# EAGLE design Sedmiseg. display (EAGLE 5.06)

## Sheet 1 of 3
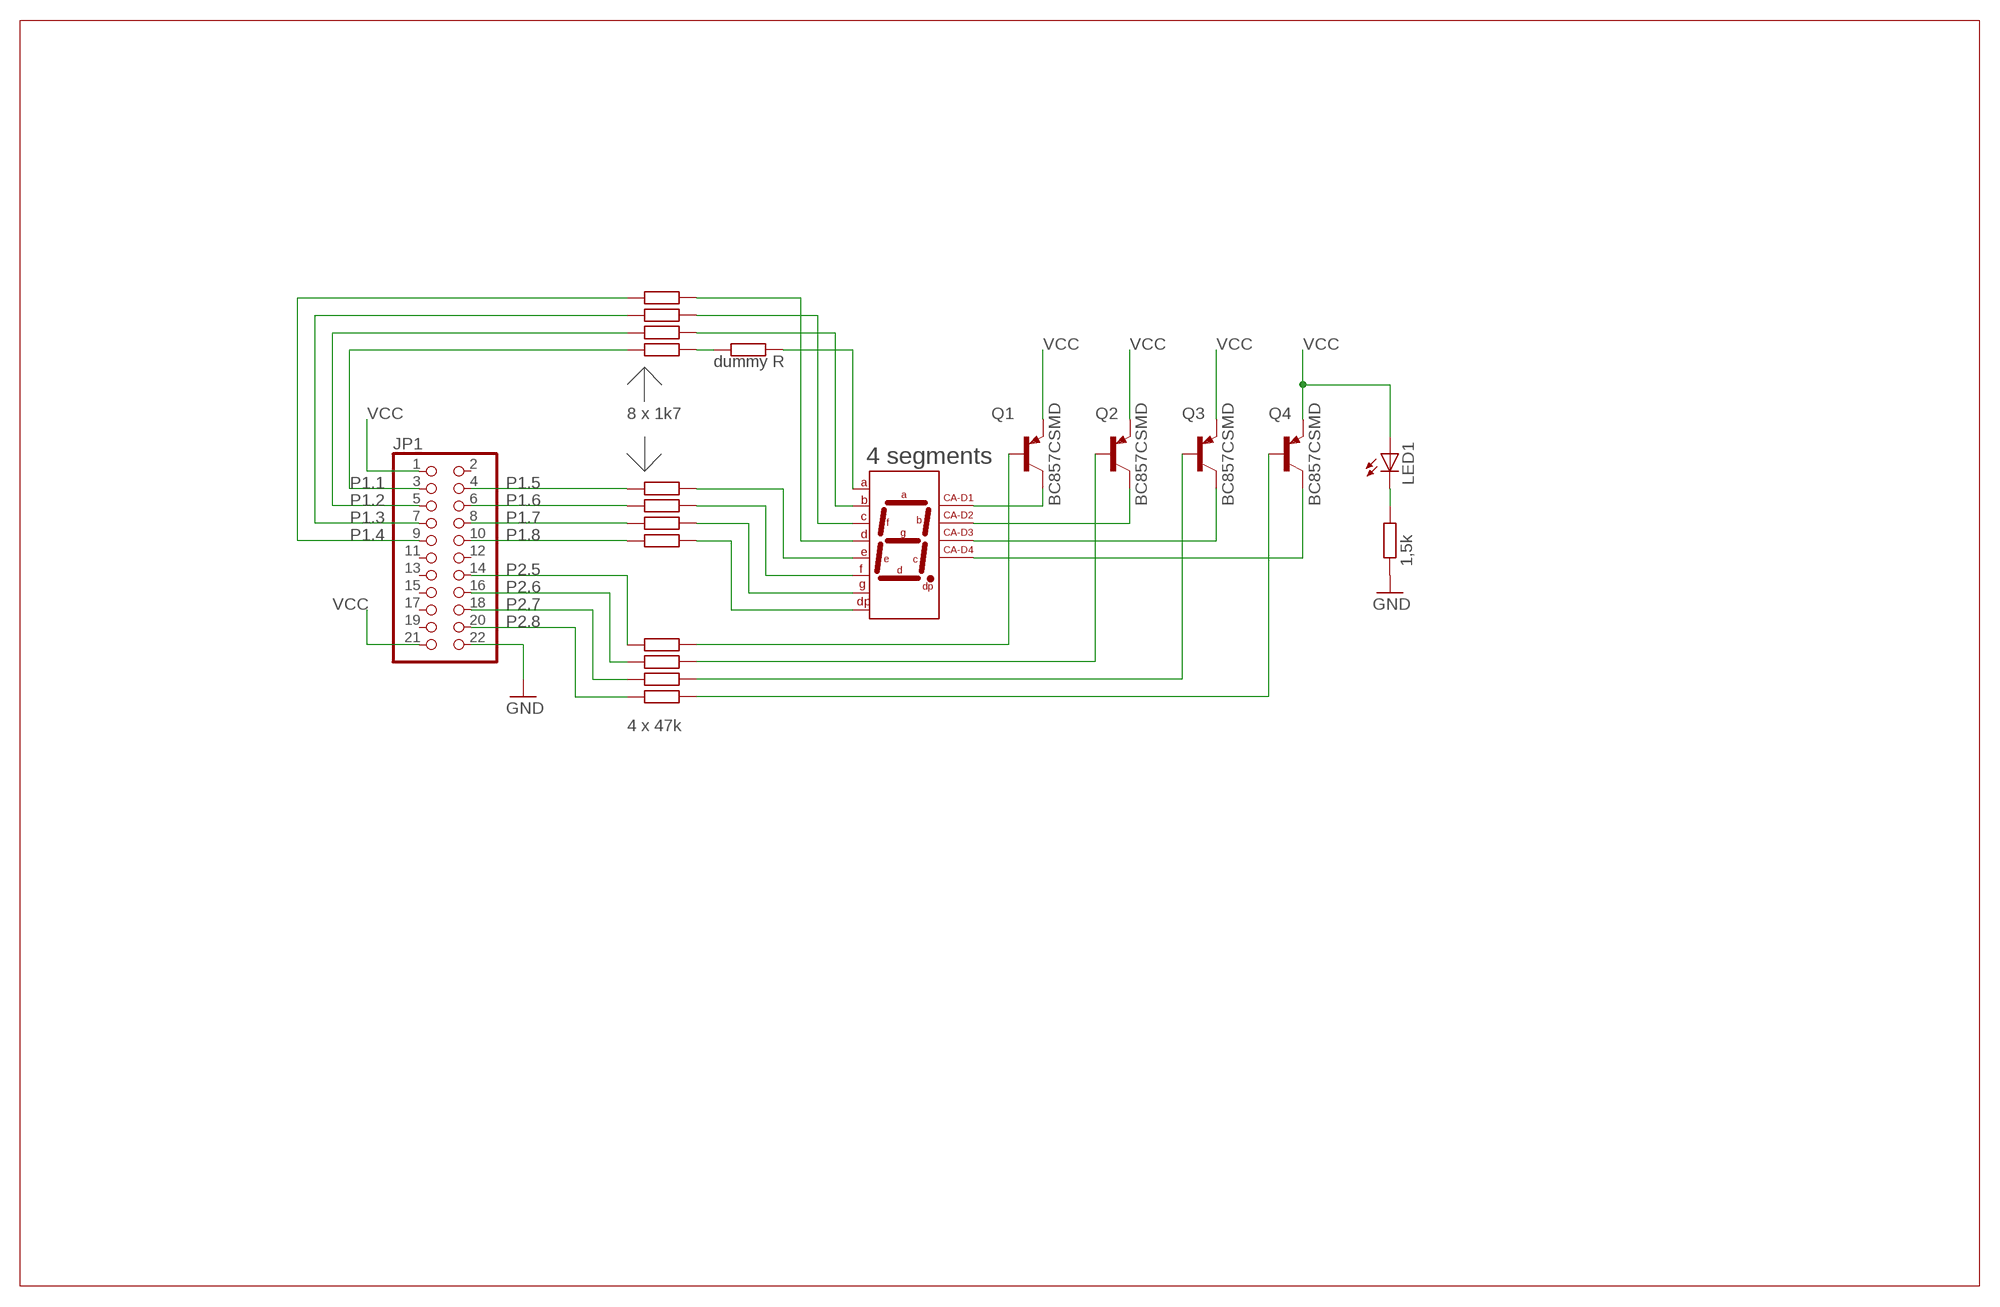
[diagram p0: schematic, sheet 1]

### Parts
H1  HD-M512RD  [HDM51X]
JP1  PINHD-2X11_2.54-90°  [2X11/90]
LED1  LED3MM  [LED3MM]
Q1  BC857CSMD  [SOT23-BEC]
Q2  BC857CSMD  [SOT23-BEC]
Q3  BC857CSMD  [SOT23-BEC]
Q4  BC857CSMD  [SOT23-BEC]
R1  R-EU_M1206  [M1206]
R2  R-EU_M1206  [M1206]
R3  R-EU_M1206  [M1206]
R4  R-EU_M1206  [M1206]
R5  R-EU_M1206  [M1206]
R6  R-EU_M1206  [M1206]
R7  R-EU_M1206  [M1206]
R8  R-EU_M1206  [M1206]
R9  R-EU_M1206  [M1206]
R10  R-EU_M1206  [M1206]
R11  R-EU_M1206  [M1206]
R12  R-EU_M1206  [M1206]
R13  R-EU_M1206  [M1206]
R14  1,5k  R-EU_M1206  [M1206]

### Nets
GND: JP1.22 R14.1
N$1: H1.12(CA-D1) Q1.C
N$2: H1.9(CA-D2) Q2.C
N$3: H1.8(CA-D3) Q3.C
N$4: H1.6(CA-D4) Q4.C
N$5: H1.10(F) R6.2
N$6: H1.5(G) R7.2
N$7: H1.3(DP) R8.2
N$8: LED1.K(C) R14.2
N$9: H1.1(E) R5.2
N$17: H1.2(D) R1.2
N$18: H1.4(C) R2.2
N$19: H1.7(B) R3.2
N$20: H1.11(A) R9.2
N$21: R4.2 R9.1
N$38: Q1.B R10.2
N$40: Q2.B R11.2
N$41: Q4.B R13.2
N$42: Q3.B R12.2
P1.1: JP1.3 R4.1
P1.2: JP1.5 R3.1
P1.3: JP1.7 R2.1
P1.4: JP1.9 R1.1
P1.5: JP1.4 R5.1
P1.6: JP1.6 R6.1
P1.7: JP1.8 R7.1
P1.8: JP1.10 R8.1
P2.5: JP1.14 R10.1
P2.6: JP1.16 R11.1
P2.7: JP1.18 R12.1
P2.8: JP1.20 R13.1
VCC: JP1.1 JP1.21 LED1.A Q1.E Q2.E Q3.E Q4.E
Unconnected: JP1.2 JP1.11 JP1.12 JP1.13 JP1.15 JP1.17 JP1.19

### Notes on the sheet
- dummy R
- 8 x 1k7
- 4 segments
- 4 x 47k

## Sheet 2 of 3
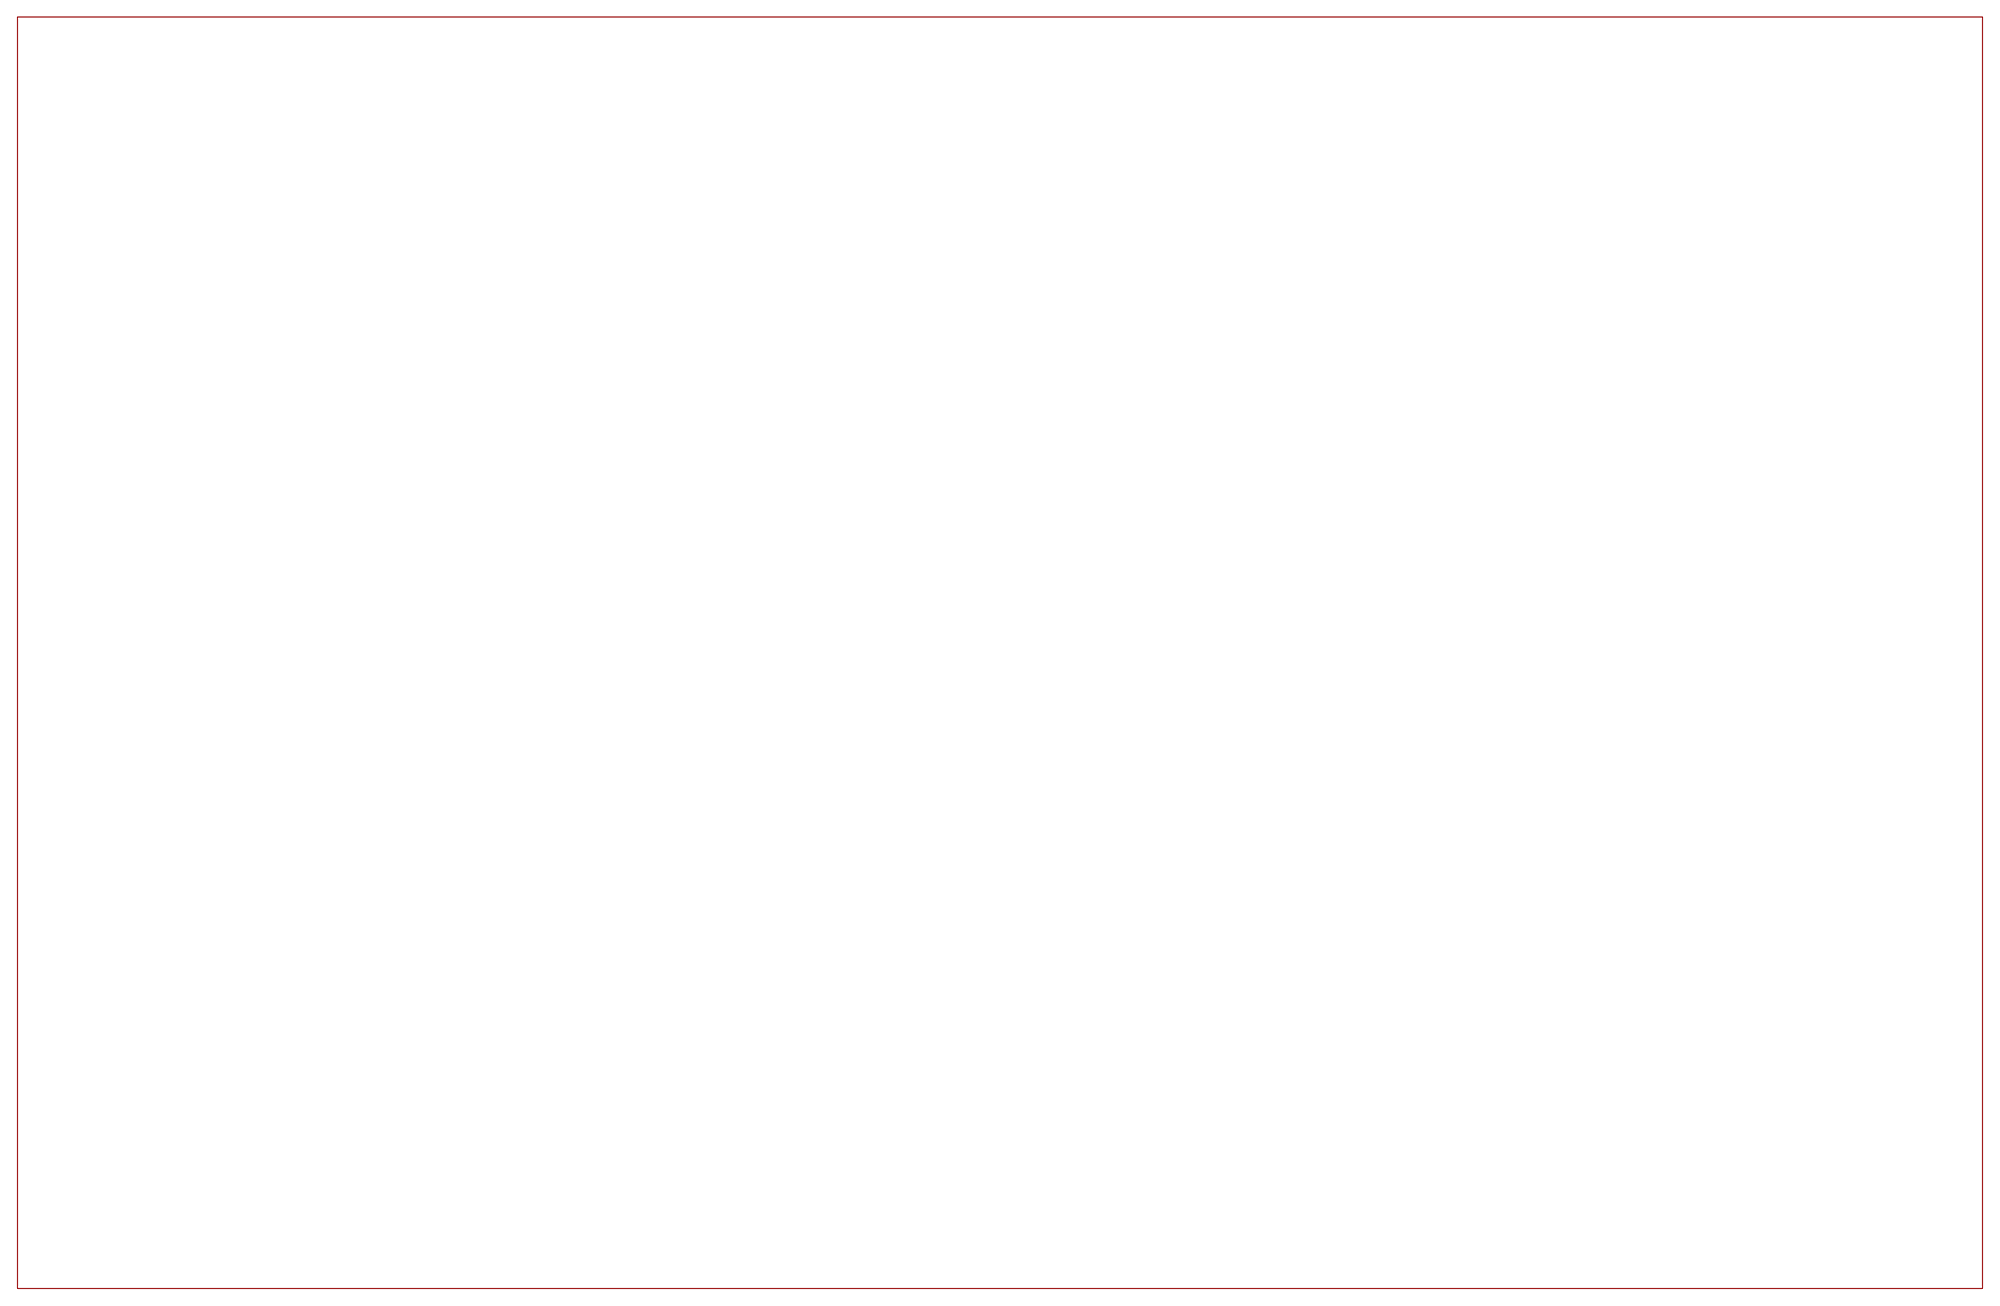
[diagram p1: schematic, sheet 2]

## Sheet 3 of 3
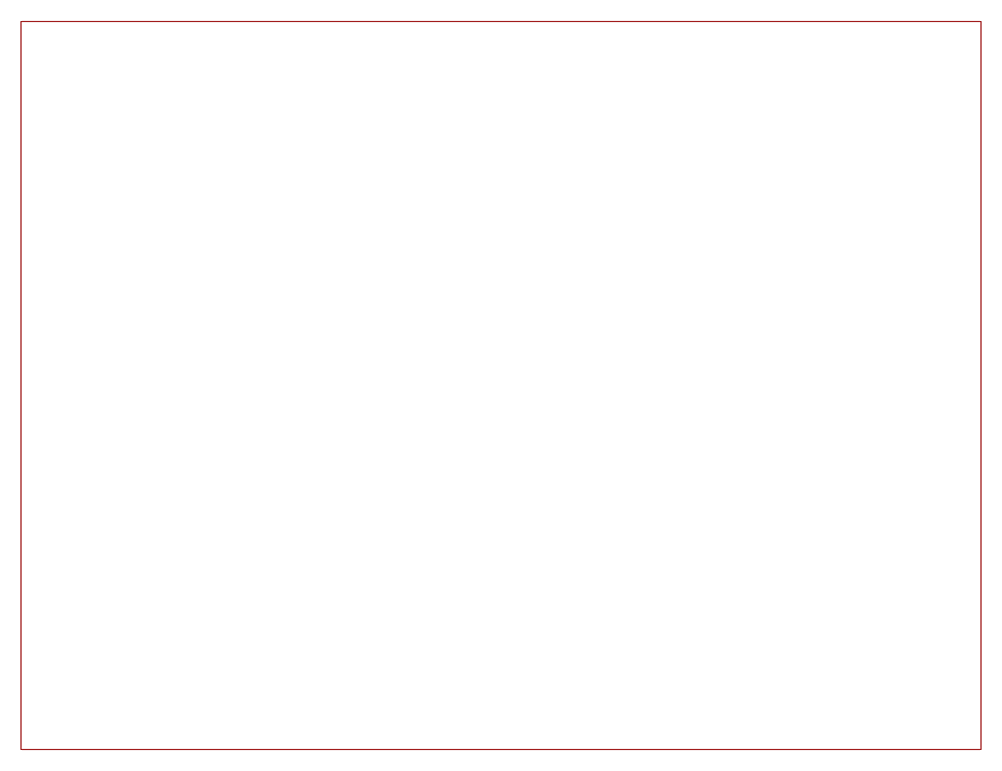
[diagram p2: schematic, sheet 3]

## Library data of the parts
H1 = #_GM99:HD-M512RD
JP1 = acon-tyco (19):PINHD-2X11: PIN HEADER
LED1 = led:LED: LED OSRAM: - CHIPLED LG R971, LG N971, LY N971, LG Q971, LY Q971, LO R971, LY R971 LH N974, LH R974 LS Q976, LO Q976, LY Q976 LO Q996 - Hyper CHIPLED LW Q18S LB Q993, LB Q99A, LB R99A - SideLED LS A670, LO A670, LY A670, LG A670, LP A670 LB A673, LV A673, LT A673, LW A673 LH A674 LY A675 LS A676, LA A676, LO A676, LY A676, LW A676 LS A679, LY A679, LG A679 - Hyper Micro SIDELED® LS Y876, LA Y876, LO Y876, LY Y876 LT Y87S - SmartLED LW L88C, LW L88S LB L89C, LB L89S, LG L890 LS L89K, LO L89K, LY L89K LS L896, LA L896, LO L896, LY L896 - TOPLED LS T670, LO T670, LY T670, LG T670, LP T670 LSG T670, LSP T670, LSY T670, LOP T670, LYG T670 LG T671, LOG T671, LSG T671 LB T673, LV T673, LT T673, LW T673 LH T674 LS T676, LA T676, LO T676, LY T676, LB T676, LH T676, LSB T676, LW T676 LB T67C, LV T67C, LT T67C, LS T67K, LO T67K, LY T67K, LW E67C LS E67B, LA E67B, LO E67B, LY E67B, LB E67C, LV E67C, LT E67C LW T67C LS T679, LY T679, LG T679 LS T770, LO T770, LY T770, LG T770, LP T770 LB T773, LV T773, LT T773, LW T773 LH T774 LS E675, LA E675, LY E675, LS T675 LS T776, LA T776, LO T776, LY T776, LB T776 LHGB T686 LT T68C, LB T68C - Hyper Mini TOPLED® LB M676 - Mini TOPLED Santana® LG M470 LS M47K, LO M47K, LY M47K Source: http://www.osram.convergy.de LUXEON: - LUMILED® LXK2-PW12-R00, LXK2-PW12-S00, LXK2-PW14-U00, LXK2-PW14-V00 LXK2-PM12-R00, LXK2-PM12-S00, LXK2-PM14-U00 LXK2-PE12-Q00, LXK2-PE12-R00, LXK2-PE12-S00, LXK2-PE14-T00, LXK2-PE14-U00 LXK2-PB12-K00, LXK2-PB12-L00, LXK2-PB12-M00, LXK2-PB14-N00, LXK2-PB14-P00, LXK2-PB14-Q00 LXK2-PR12-L00, LXK2-PR12-M00, LXK2-PR14-Q00, LXK2-PR14-R00 LXK2-PD12-Q00, LXK2-PD12-R00, LXK2-PD12-S00 LXK2-PH12-R00, LXK2-PH12-S00 LXK2-PL12-P00, LXK2-PL12-Q00, LXK2-PL12-R00 Source: www.luxeon.com KINGBRIGHT: KA-3528ASYC Source: www.kingbright.com
Q1-Q4 = transistor-pnp:BC857*: PNP Transistror
R1-R14 = resistor:R-EU_: RESISTOR, European symbol

## Board
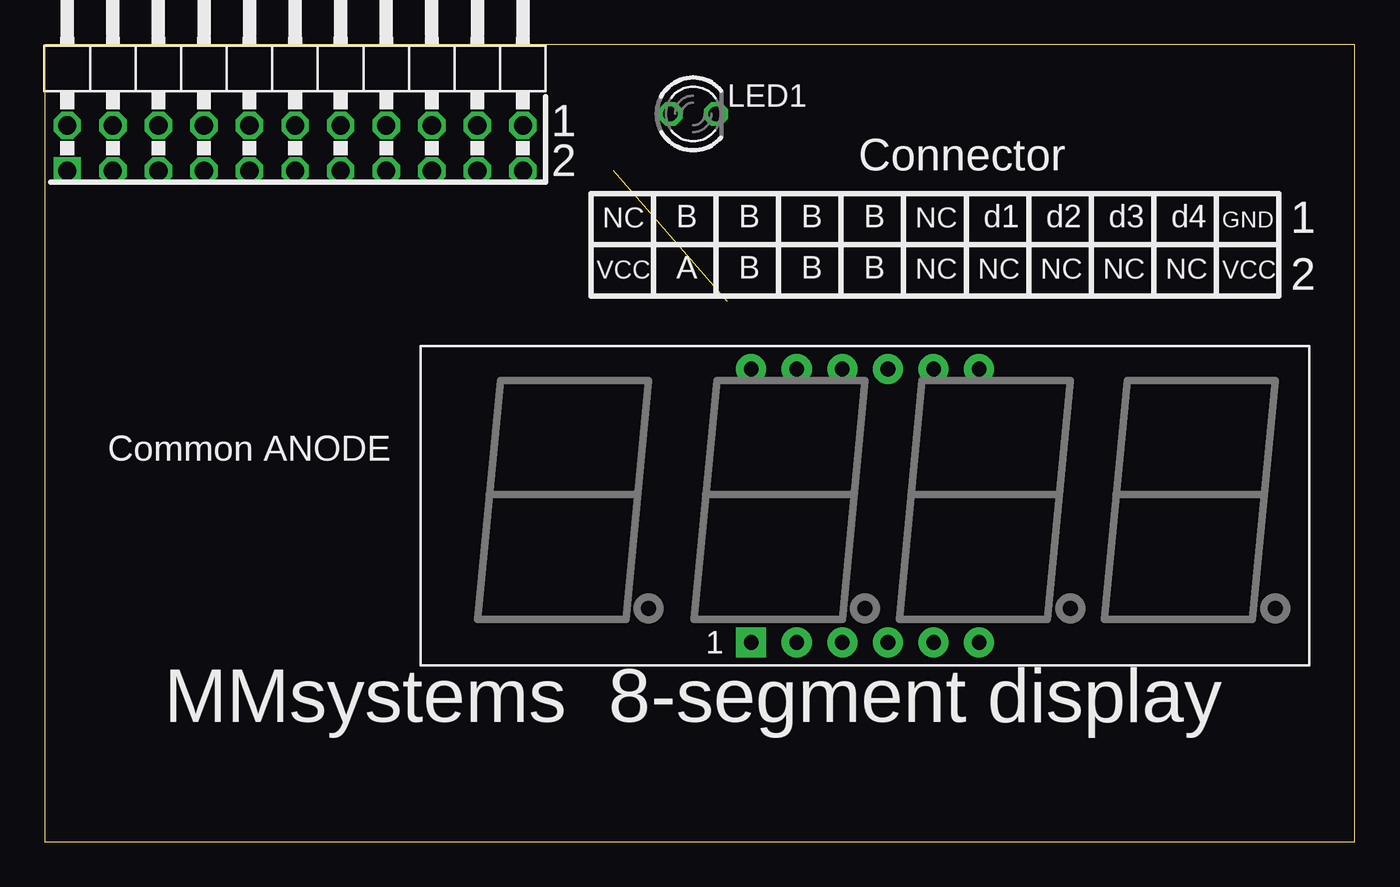
[diagram p3: board, top side]
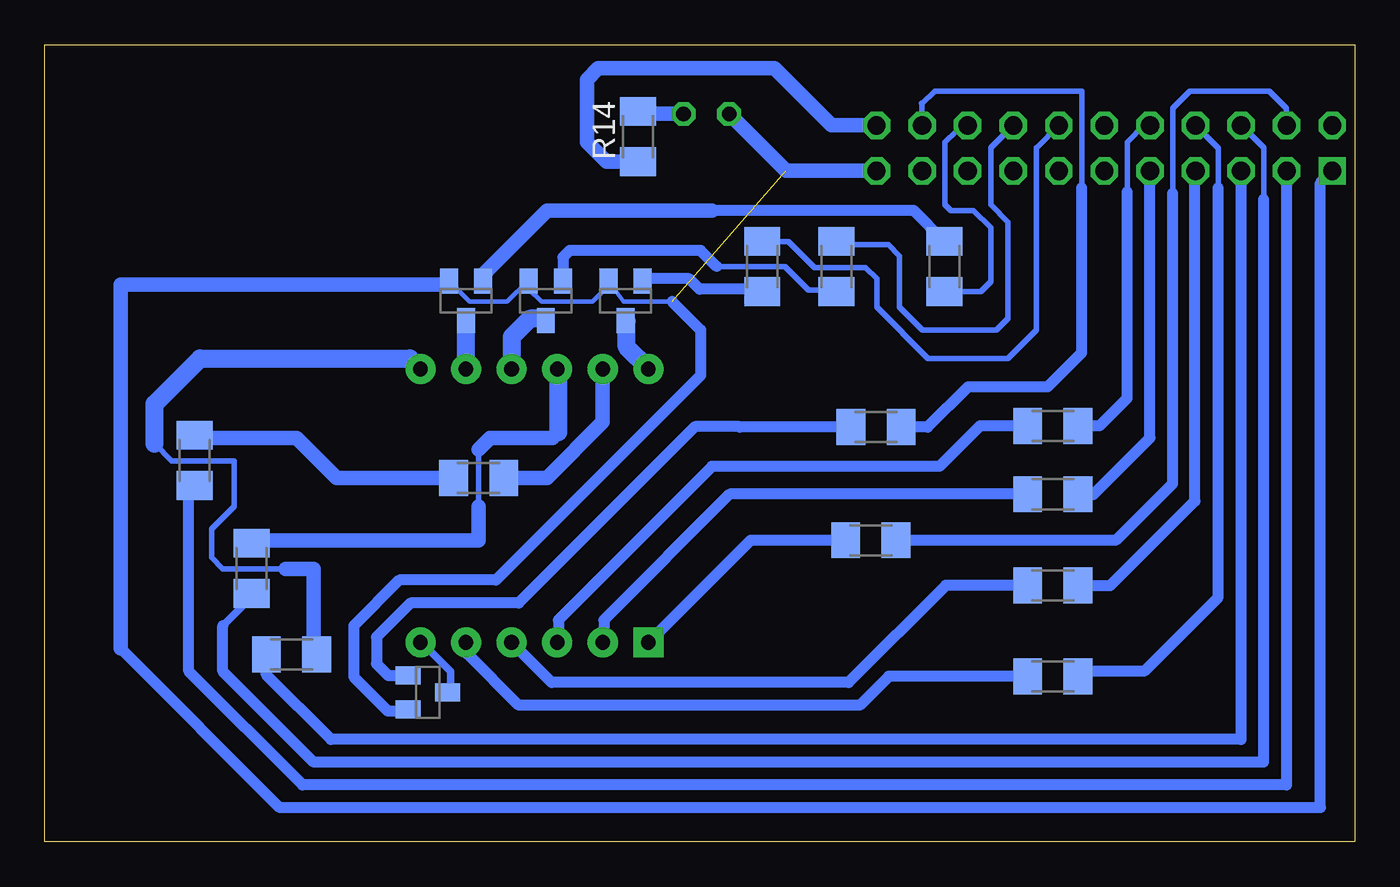
[diagram p4: board, bottom side, seen from below]

Size 73 x 44.43 mm. Coordinates in mm from the lower left corner, seen from the top.
Outline: 0,0 73,0 73,44.43 0,44.43 0,0
Copper layers (1*16): Top 0.035mm / dielectric 1.5mm / Bottom 0.035mm
Design rules "default": minimum track width 10mil, minimum drill 24mil, track to track 8mil, track to pad 8mil, pad to pad 8mil, via to via 8mil, smd to smd 8mil, copper to edge 40mil, drill to drill 8mil, minimum pad ring 10mil, minimum via ring 8mil, stop-mask expansion 4mil, vias tented up to drill 0mil, thermal gap 10mil

### Footprints (pad centres in the part's own frame; a part is rotated, then mirrored left to right if it is on the bottom)
HDM51X = drill 0.813 pad 1.676 square: 1 0,0 | drill 0.813 pad 1.676 round: 2 2.54,0; 3 5.08,0; 4 7.62,0; 5 10.16,0; 6 12.7,0; 7 12.7,15.24; 8 10.16,15.24; 9 7.62,15.24; 10 5.08,15.24; 11 2.54,15.24; 12 0,15.24
2X11/90 = drill 1.016 square: 1 -12.7,-6.35 | drill 1.016 octagon: 2 -12.7,-3.81; 3 -10.16,-6.35; 4 -10.16,-3.81; 5 -7.62,-6.35; 6 -7.62,-3.81; 7 -5.08,-6.35; 8 -5.08,-3.81; 9 -2.54,-6.35; 10 -2.54,-3.81; 11 0,-6.35; 12 0,-3.81; 13 2.54,-6.35; 14 2.54,-3.81; 15 5.08,-6.35; 16 5.08,-3.81; 17 7.62,-6.35; 18 7.62,-3.81; 19 10.16,-6.35; 20 10.16,-3.81; 21 12.7,-6.35; 22 12.7,-3.81
LED3MM = drill 0.813 octagon: A -1.27,0; K 1.27,0
SOT23-BEC = smd 1 x 1.4: B -0.95,-1.1; C 0,1.1; E 0.95,-1.1
M1206 = smd 1.6 x 2: 1 -1.4,0; 2 1.4,0

### Placement (x,y rotation side)
H1  39.37,11.11 0 top
JP1  13.95,43.75 0 top
LED1  36.14,40.58 0 top
Q1  40.64,30.16 180 bottom
Q2  45.08,30.16 180 bottom
Q3  49.53,30.16 180 bottom
Q4  51.66,8.32 270 bottom
R1  16.82,19.37 180 bottom
R2  16.82,14.3 180 bottom
R3  59.26,10.44 0 bottom
R4  64.66,21.26 90 bottom
R5  26.97,16.81 180 bottom
R6  61.48,15.24 90 bottom
R7  16.82,9.22 180 bottom
R8  16.82,23.18 180 bottom
R9  48.82,20.29 0 bottom
R10  33.02,32.07 270 bottom
R11  28.89,32.07 270 bottom
R12  22.86,32.07 90 bottom
R13  26.68,23.11 180 bottom
R14  39.94,39.31 90 bottom

### Tracks (layer width: path | path; a pad name or v marks a point on that pad's centre or on a via)
GND
  Bottom 0.813: R14.1 41.71,37.91 42.8,38.99 42.8,42.48 42.16,43.11 33.95,43.11 32.33,43.11 29.16,39.94 JP1.22
N$1
  Bottom 0.406: H1.12 39.37,26.37 | 40.58,29 Q1.C
  Bottom 1.016: 39.37,26.37 40.58,27.58 40.58,29
N$2
  Bottom 0.305: Q2.C 45.19,29.16
  Bottom 1.016: H1.9 46.99,28.14 45.97,29.16 45.19,29.16
N$3
  Bottom 1.016: H1.8 Q3.C
N$4
  Bottom 0.406: H1.6 52.01,11.11 50.4,9.51 50.4,8.48 Q4.C
N$5
  Bottom 0.305: 44.38,26.28 H1.10 | 48.82,18.7 48.82,21.87
  Bottom 0.813: 48.82,21.87 48.18,22.51 44.7,22.51 44.38,22.82 | R6.2 61.48,16.8 48.82,16.8 48.82,18.7
  Bottom 1.016: 44.38,22.82 44.38,26.28
N$6
  Bottom 0.61: R7.2 25.97,9.22 27.58,7.61 46.6,7.61 49.45,10.46 49.45,11.04 H1.5
N$7
  Bottom 0.61: R8.2 20.88,23.18 23.14,20.92 35.82,20.92 44.38,12.36 44.38,11.18 H1.3
N$8
  Bottom 0.813: LED1.K 39.49,40.58 R14.2
N$9
  Bottom 0.61: R5.2 33.67,16.81 H1.1
N$17
  Bottom 0.61: R1.2 34.83,19.37 41.84,12.36 41.84,11.1 42.16,10.78 42.16,10.86 H1.2
N$18
  Bottom 0.61: R2.2 22.79,14.3 28.21,8.88 44.75,8.88 H1.4
N$19
  Bottom 0.305: 59.6,15.22 63.08,15.22 63.72,15.85 63.72,17.43 62.45,18.7 62.45,21.24 65.94,21.24 66.89,22.19
  Bottom 0.406: R3.2 58.01,10.59
  Bottom 0.813: 58.01,10.59 58.01,15.22 59.6,15.22
  Bottom 1.016: 66.89,22.19 66.89,24.41 64.35,26.95 52.66,26.95 H1.7
N$20
  Bottom 0.813: H1.11 41.91,23.39 45.01,20.29 R9.2
N$21
  Bottom 0.254: R4.2 64.49,22.82
  Bottom 0.813: R9.1 56.74,20.29 58.96,22.51 64.5,22.51 R4.2
N$38
  Bottom 0.305: 33.65,30.8 33.15,30.8 R10.2
  Bottom 0.61: 33.65,30.8 36.5,30.8 37.09,31.38 39.57,31.38 Q1.B
N$40
  Bottom 0.305: 35.56,32.07 31.75,32.07 31.75,32.06 30.43,30.75 28.97,30.75 R11.2
  Bottom 0.61: Q2.B 44.13,32.58 43.75,32.97 36.46,32.97 35.56,32.07
N$41
  Bottom 0.61: R13.2 34.26,23.11 34.29,23.14 36.77,23.14 46.6,13.31 52.62,13.31 54.52,11.41 54.52,9.93 53.87,9.27 Q4.B
N$42
  Bottom 0.305: 48.5,31.7 48.14,31.7 Q3.B
  Bottom 0.61: 35.82,35.19 24.58,35.19 R12.2
  Bottom 0.813: 48.5,31.7 45.01,35.19 35.82,35.19
P1.1
  Bottom 0.305: R4.1 | JP1.3 3.8,37.38
  Bottom 0.61: R4.1 64.98,19.85 64.98,9.51 58.65,3.17 3.79,3.17 JP1.3
P1.2
  Bottom 0.305: JP1.5 6.33,37.39 6.34,37.38
  Bottom 0.61: R3.1 60.66,9.3 57.06,5.71 6.33,5.71 JP1.5
P1.3
  Bottom 0.305: R2.1 15.41,14.29 | 8.9,37.37 JP1.7
  Bottom 0.61: 8.9,37.37 8.9,19 13.63,14.27 15.39,14.27 R2.1
P1.4
  Bottom 0.61: JP1.9 11.41,22.51 14.58,19.34 15.39,19.34 R1.1
P1.5
  Bottom 0.305: 10.14,36.14 10.14,40.89 9.19,41.84 4.75,41.84 3.8,40.89 3.8,39.95 JP1.4 3.82,39.97
  Bottom 0.61: 10.14,36.14 10.14,19.97 13.31,16.8 R5.1
P1.6
  Bottom 0.305: JP1.6 5.07,38.68 5.07,35.82
  Bottom 0.406: R6.1 61.48,13.65 63.08,12.05
  Bottom 0.61: 63.08,12.05 63.08,9.51 58.01,4.44 5.07,4.44 5.07,35.82
P1.7
  Bottom 0.305: R7.1 15.42,9.62 | 7.61,36.45 7.61,38.68 JP1.8
  Bottom 0.61: 7.61,36.45 7.61,13.63 11.73,9.51 15.13,9.51 R7.1
P1.8
  Bottom 0.305: 12.68,36.22 12.68,38.99 11.74,39.94 JP1.10
  Bottom 0.61: R8.1 14.22,23.18 12.68,24.73 12.68,36.22
P2.5
  Bottom 0.305: R10.1 31.57,33.47 30.11,32.02 27.26,32.02 26.63,31.38 26.63,29.8 23.77,26.95 19.34,26.95 17.75,28.53 17.75,38.7 17.72,38.7 JP1.14
P2.6
  Bottom 0.305: R11.1 28.71,33.28 25.99,33.28 25.36,32.65 25.36,29.8 24.09,28.53 19.97,28.53 19.34,29.16 19.34,34.55 20.29,35.5 20.29,38.71 19.37,39.62 19.02,39.62 19.03,39.63 JP1.16
P2.7
  Bottom 0.305: R12.1 20.84,30.67 20.29,31.22 20.29,34.24 21.24,35.19 22.51,35.19 22.82,35.5 22.82,38.99 22.19,39.62 21.91,39.62 21.6,39.94 JP1.18
P2.8
  Bottom 0.305: 15.22,36.14 15.22,36.45 15.22,41.84 23.4,41.84 24.11,41.13 | 24.11,41.13 JP1.20 | 24.11,41.13 24.14,41.16
  Bottom 0.61: R13.1 23.8,23.11 21.56,25.36 17.12,25.36 15.22,27.26 15.22,36.45
VCC  (1 unrouted)
  Bottom 0.254: 38.04,30.11 40.76,30.11 Q1.E 41.47,31.07 41.53,31.07 42.48,30.11 45.33,30.11 46.03,30.82 Q2.E 46.09,31.26 47.23,30.11 49.33,30.11 Q3.E 50.68,31.07
  Bottom 0.305: JP1.1 1.28,37.37
  Bottom 0.406: JP1.21 | 52.84,7.29 Q4.E
  Bottom 0.61: 38.04,30.11 36.45,28.53 36.45,25.99 47.87,14.58 53.26,14.58 55.79,12.05 55.79,9.19 53.89,7.29 52.84,7.29 | 68.79,10.78 59.91,1.9 1.9,1.9 1.9,36.74 JP1.1
  Bottom 0.813: 50.68,31.07 68.79,31.07 68.79,10.78 | JP1.21 31.7,37.41 LED1.A

### Text on the board
tNames: 1 | 2 | Connector | NC | B | B | B | B | NC | d1 | d2 | d3 | d4 | GND | 1 | VCC | A | B | B | B | NC | NC | NC | NC | NC | VCC | 2 | Common ANODE | MMsystems 8-segment display